# Altium project USB_Downloader.PrjPcb
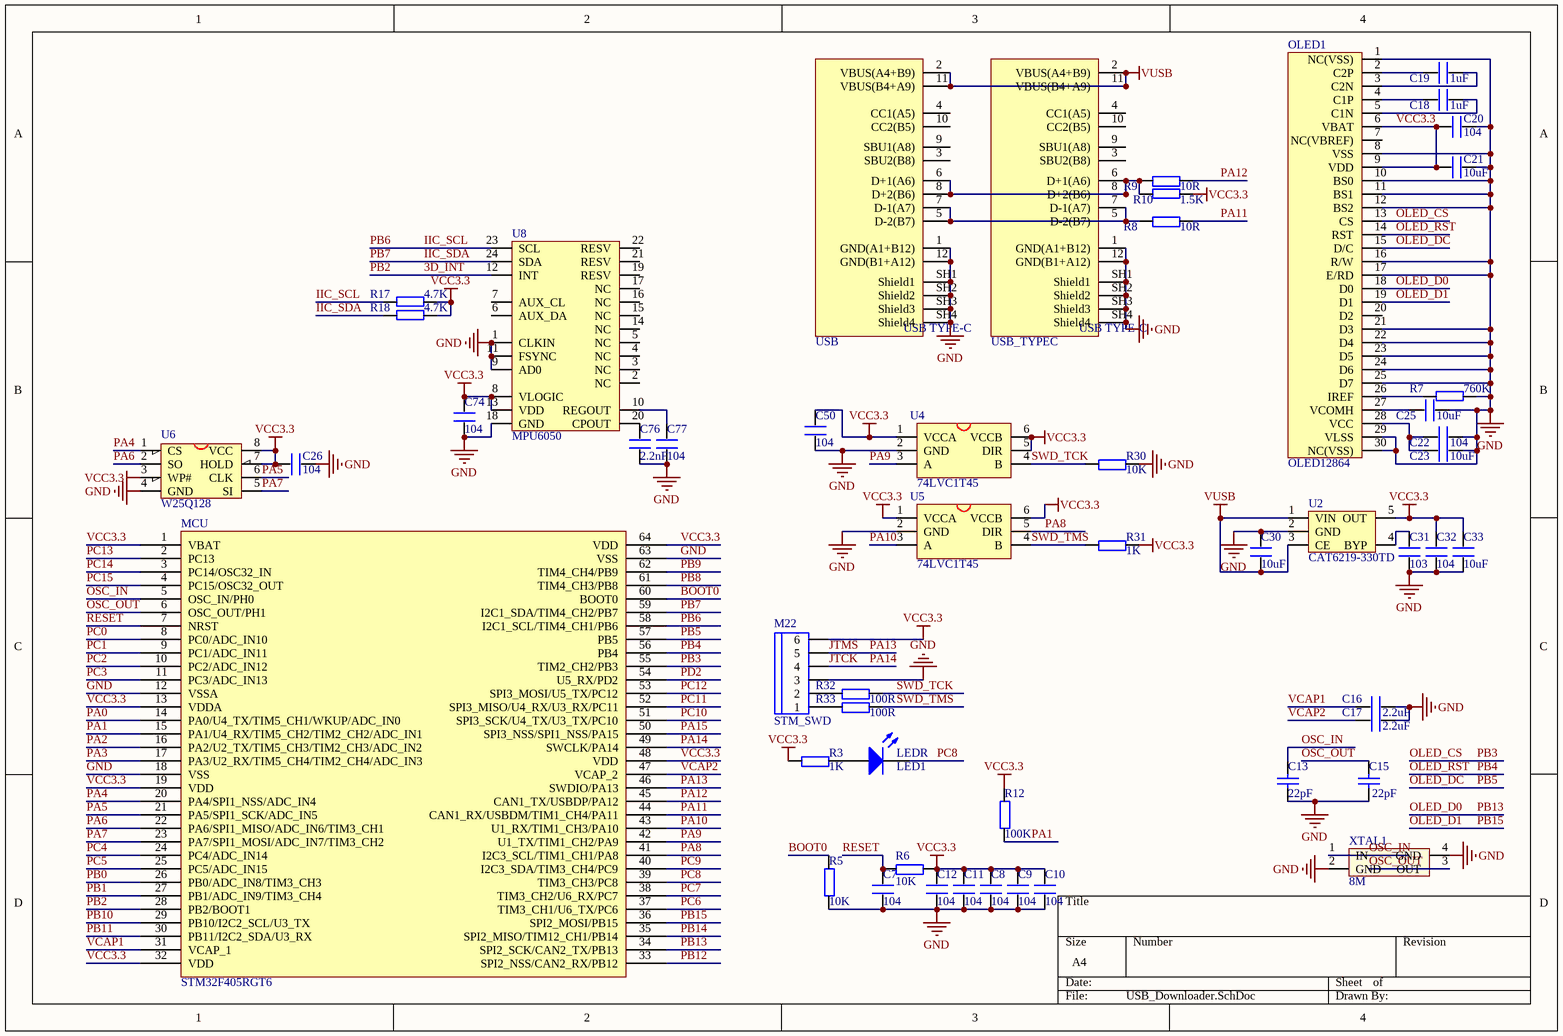
[diagram p0: USB_Downloader.SchDoc]
1 sheet, 52 parts. Net scope: global (net labels, ports and power ports of the same name join across sheets).
Board file: USB_Downloader.PcbDoc

## Sheet USB_Downloader.SchDoc
size A4

### Parts
C7  104  [C 0603_L]
C8  104  [C 0603_L]
C9  104  [C 0603_L]
C10  104  [C 0603_L]
C11  104  [C 0603_L]
C12  104  [C 0603_L]
C13  22pF  [C 0603_L]
C15  22pF  [C 0603_L]
C16  2.2uF  [C 0603_L]
C17  2.2uF  [C 0603_L]
C18  1uF  [C 0603_L]
C19  1uF  [C 0603_L]
C20  104  [C 0603_L]
C21  10uF  [C 0603_L]
C22  104  [C 0603_L]
C23  10uF  [C 0603_L]
C25  10uF  [C 0603_L]
C26  104  [C 0603_L]
C30  10uF  [C 0603_L]
C31  103  [C 0603_L]
C32  104  [C 0603_L]
C33  10uF  [C 0603_L]
C50  104  [C 0603_L]
C74  104  [C 0603_L]
C76  2.2nF  [C 0603_L]
C77  104  [C 0603_L]
LEDR  LED1  [LED 0805B]
M22  STM_SWD  [SH1.0-6P]
MCU  STM32F405RGT6  [LQFP64 10X10_L]
OLED1  OLED12864  [OLED_0.96]
R3  1K  [R 0603_L]
R5  10K  [R 0603_L]
R6  10K  [R 0603_L]
R7  760K  [R 0603_L]
R8  10R  [R 0603_L]
R9  10R  [R 0603_L]
R10  1.5K  [R 0603_L]
R12  100K  [R 0603_L]
R17  4.7K  [R 0603_L]
R18  4.7K  [R 0603_L]
R30  10K  [R 0603_L]
R31  1K  [R 0603_L]
R32  100R  [R 0603_L]
R33  100R  [R 0603_L]
U2  CAT6219-330TD  [SOT23-5L]
U4  74LVC1T45  [SOT363-6L]
U5  74LVC1T45  [SOT363-6L]
U6  W25Q128  [SOP8W_L]
U8  MPU6050  [QFN24 4x4_N]
USB  USB TypeC  [USB Type-C]  (value not drawn)
USB_TYPEC  USB TypeC  [USB Type-C]  (value not drawn)
XTAL1  8M  [XTAL3225   无源]

### Nets
GND: C7.1 C8.1 C9.1 C10.1 C11.1 C12.1 C13.1 C15.1 C16.1 C17.1 C20.1 C21.1 C22.1 C23.1 C25.1 C26.2 C30.2 C31.1 C32.1 C33.1 C50.1 C74.1 C76.1 C77.2 M22.3 MCU.12(VSSA) MCU.18(VSS) MCU.63(VSS) OLED1.1(NC(VSS)) OLED1.8(VSS) OLED1.10(BS0) OLED1.11(BS1) OLED1.12(BS2) OLED1.16(R/W) OLED1.17(E/RD) OLED1.21(D3) OLED1.22(D4) OLED1.23(D5) OLED1.24(D6) OLED1.25(D7) OLED1.29(VLSS) OLED1.30(NC(VSS)) R5.1 R7.1 R30.2 U2.2(GND) U4.2(GND) U5.2(GND) U6.4(GND) U8.1(CLKIN) U8.9(AD0) U8.11(FSYNC) U8.18(GND) USB.1(GND(A1+B12)) USB.12(GND(B1+A12)) USB.SH1(Shield1) USB.SH2(Shield2) USB.SH3(Shield3) USB.SH4(Shield4) USB_TYPEC.1(GND(A1+B12)) USB_TYPEC.12(GND(B1+A12)) USB_TYPEC.SH1(Shield1) USB_TYPEC.SH2(Shield2) USB_TYPEC.SH3(Shield3) USB_TYPEC.SH4(Shield4) XTAL1.2(GND) XTAL1.4(GND)
VCC3.3: C8.2 C9.2 C10.2 C11.2 C12.2 C20.2 C21.2 C26.1 C32.2 C33.2 C50.2 C74.2 M22.6 MCU.1(VBAT) MCU.13(VDDA) MCU.19(VDD) MCU.32(VDD) MCU.48(VDD) MCU.64(VDD) OLED1.6(VBAT) OLED1.9(VDD) R3.1 R6.2 R10.1 R12.2 R17.1 R18.1 R31.2 U2.5(OUT) U4.1(VCCA) U4.5(DIR) U4.6(VCCB) U5.1(VCCA) U5.6(VCCB) U6.3(WP#) U6.7(HOLD) U6.8(VCC) U8.8(VLOGIC) U8.13(VDD)
VUSB: C30.1 U2.1(VIN) U2.3(CE) USB.2(VBUS(A4+B9)) USB.11(VBUS(B4+A9)) USB_TYPEC.2(VBUS(A4+B9)) USB_TYPEC.11(VBUS(B4+A9))
3D_INT: MCU.28(PB2/BOOT1) U8.12(INT)  [also labelled PB2]
BOOT0: MCU.60(BOOT0) R5.2
IIC_SCL: MCU.58(I2C1_SCL/TIM4_CH1/PB6) R17.2 U8.23(SCL)  [also labelled PB6]
IIC_SDA: MCU.59(I2C1_SDA/TIM4_CH2/PB7) R18.2 U8.24(SDA)  [also labelled PB7]
JTCK: M22.4 MCU.49(SWCLK/PA14)  [also labelled PA14]
JTMS: M22.5 MCU.46(SWDIO/PA13)  [also labelled PA13]
OLED_CS: MCU.55(TIM2_CH2/PB3) OLED1.13(CS)  [also labelled PB3]
OLED_D0: MCU.34(SPI2_SCK/CAN2_TX/PB13) OLED1.18(D0)  [also labelled PB13]
OLED_D1: MCU.36(SPI2_MOSI/PB15) OLED1.19(D1)  [also labelled PB15]
OLED_DC: MCU.57(PB5) OLED1.15(D/C)  [also labelled PB5]
OLED_RST: MCU.56(PB4) OLED1.14(RST)  [also labelled PB4]
OSC_IN: C13.2 MCU.5(OSC_IN/PH0) XTAL1.1(IN)
OSC_OUT: C15.2 MCU.6(OSC_OUT/PH1) XTAL1.3(OUT)
PA0: MCU.14(PA0/U4_TX/TIM5_CH1/WKUP/ADC_IN0)
PA1: MCU.15(PA1/U4_RX/TIM5_CH2/TIM2_CH2/ADC_IN1) R12.1
PA2: MCU.16(PA2/U2_TX/TIM5_CH3/TIM2_CH3/ADC_IN2)
PA3: MCU.17(PA3/U2_RX/TIM5_CH4/TIM2_CH4/ADC_IN3)
PA4: MCU.20(PA4/SPI1_NSS/ADC_IN4) U6.1(CS)
PA5: MCU.21(PA5/SPI1_SCK/ADC_IN5) U6.6(CLK)
PA6: MCU.22(PA6/SPI1_MISO/ADC_IN6/TIM3_CH1) U6.2(SO)
PA7: MCU.23(PA7/SPI1_MOSI/ADC_IN7/TIM3_CH2) U6.5(SI)
PA8: MCU.41(I2C3_SCL/TIM1_CH1/PA8) U5.5(DIR)
PA9: MCU.42(U1_TX/TIM1_CH2/PA9) U4.3(A)
PA10: MCU.43(U1_RX/TIM1_CH3/PA10) U5.3(A)
PA11: MCU.44(CAN1_RX/USBDM/TIM1_CH4/PA11) R8.2
PA12: MCU.45(CAN1_TX/USBDP/PA12) R9.2
PA15: MCU.50(SPI3_NSS/SPI1_NSS/PA15)
PB0: MCU.26(PB0/ADC_IN8/TIM3_CH3)
PB1: MCU.27(PB1/ADC_IN9/TIM3_CH4)
PB8: MCU.61(TIM4_CH3/PB8)
PB9: MCU.62(TIM4_CH4/PB9)
PB10: MCU.29(PB10/I2C2_SCL/U3_TX)
PB11: MCU.30(PB11/I2C2_SDA/U3_RX)
PB12: MCU.33(SPI2_NSS/CAN2_RX/PB12)
PB14: MCU.35(SPI2_MISO/TIM12_CH1/PB14)
PC0: MCU.8(PC0/ADC_IN10)
PC1: MCU.9(PC1/ADC_IN11)
PC2: MCU.10(PC2/ADC_IN12)
PC3: MCU.11(PC3/ADC_IN13)
PC4: MCU.24(PC4/ADC_IN14)
PC5: MCU.25(PC5/ADC_IN15)
PC6: MCU.37(TIM3_CH1/U6_TX/PC6)
PC7: MCU.38(TIM3_CH2/U6_RX/PC7)
PC8: LEDR.2(K) MCU.39(TIM3_CH3/PC8)
PC9: MCU.40(I2C3_SDA/TIM3_CH4/PC9)
PC10: MCU.51(SPI3_SCK/U4_TX/U3_TX/PC10)
PC11: MCU.52(SPI3_MISO/U4_RX/U3_RX/PC11)
PC12: MCU.53(SPI3_MOSI/U5_TX/PC12)
PC13: MCU.2(PC13)
PC14: MCU.3(PC14/OSC32_IN)
PC15: MCU.4(PC15/OSC32_OUT)
PD2: MCU.54(U5_RX/PD2)
RESET: C7.2 MCU.7(NRST) R6.1
SWD_TCK: R30.1 R32.2 U4.4(B)
SWD_TMS: R31.1 R33.2 U5.4(B)
VCAP1: C16.2 MCU.31(VCAP_1)
VCAP2: C17.2 MCU.47(VCAP_2)
NetC18_1: C18.1 OLED1.5(C1N)
NetC18_2: C18.2 OLED1.4(C1P)
NetC19_1: C19.1 OLED1.3(C2N)
NetC19_2: C19.2 OLED1.2(C2P)
NetC22_2: C22.2 C23.2 OLED1.28(VCC)
NetC25_2: C25.2 OLED1.27(VCOMH)
NetC31_2: C31.2 U2.4(BYP)
NetC76_2: C76.2 U8.20(CPOUT)
NetC77_1: C77.1 U8.10(REGOUT)
NetLEDR_1: LEDR.1(A) R3.2
NetM22_1: M22.1 R33.1
NetM22_2: M22.2 R32.1
NetOLED1_26: OLED1.26(IREF) R7.2
NetR8_1: R8.1 USB.5(D-2(B7)) USB.7(D-1(A7)) USB_TYPEC.5(D-2(B7)) USB_TYPEC.7(D-1(A7))
NetR9_1: R9.1 R10.2 USB.6(D+1(A6)) USB.8(D+2(B6)) USB_TYPEC.6(D+1(A6)) USB_TYPEC.8(D+2(B6))

Not connected (* = marked no-connect by the designer): OLED1 7(NC(VBREF)) 20(D2); U8 2(NC) 3(NC) 4(NC) 5(NC) 6(AUX_DA) 7(AUX_CL) 14(NC) 15(NC) 16(NC) 17(NC) 19(RESV) 21(RESV) 22(RESV); USB 3(SBU2(B8)) 4(CC1(A5)) 9(SBU1(A8)) 10(CC2(B5)); USB_TYPEC 3(SBU2(B8)) 4(CC1(A5)) 9(SBU1(A8)) 10(CC2(B5))

### Notes on the sheet
- (in symbol USB Type-C) USB TYPE-C

### Library data of the parts
C7-C12 C16-C23 C25 C26 C30-C33 C50 C74 C76 C77 = C
C13 C15 = CAP
LEDR = LED2: Typical RED, GREEN, YELLOW, AMBER GaAs LED; Published: 8-Jun-2000; LatestRevisionDate: 17-Jul-2002; LatestRevisionNote: Re-released for DXP Platform.; PackageDocument: Feb-2002; PackageReference: 3.2X1.6X1.1; Publisher: Altium Limited
M22 = HEAD6
MCU = STM32F405RGT6: Flaah:256/RAM:48/IO:51
R3 R5-R10 R12 R17 R18 R30-R33 = R
U2 = CAT6219-330TD: 3.3V 500mA LDO
U4 U5 = 74LVC1T45: 1路双向电平转换
U6 = W25X16: W25X16;SST25VF016;MX25L1605
U8 = MPU6050: 9轴运动处理传感器
USB USB_TYPEC = USB Type-C: 12P TypeC 母座
XTAL1 = XTAL-无源贴片: 无源贴片晶振